# EAGLE design mosfet_ver2 (EAGLE 6.6.0)
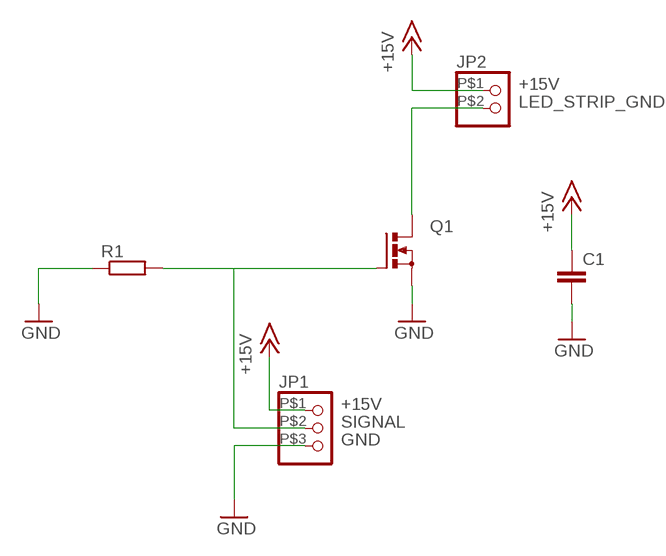
[diagram p0: schematic, sheet 1]

## Parts
C1  C-EU050-025X075  [C050-025X075]
JP1  PINHD-1X35.08  [1X03/5.08]
JP2  PINHD-1X2/5.08  [1X02/5.08]
Q1  PMOSFET_NTO220BV  [TO220BV]
R1  R-EU_M0805  [M0805]

## Nets
+15V: C1.1 JP1.P$1 JP2.P$1
GND: C1.2 JP1.P$3 Q1.S R1.1
LED_STRIP_GND: JP2.P$2 Q1.D
SIGNAL: JP1.P$2 Q1.G R1.2

## Library data of the parts
C1 = rcl:C-EU: CAPACITOR, European symbol
JP1 = 1omat:PINHD-1X3: PIN HEADER
JP2 = 1omat:PINHD-1X2: PIN HEADER
Q1 = transistor-power:PMOSFET_N: Power MOSFET N-Channel
R1 = resistor:R-EU_: RESISTOR, European symbol

## Board
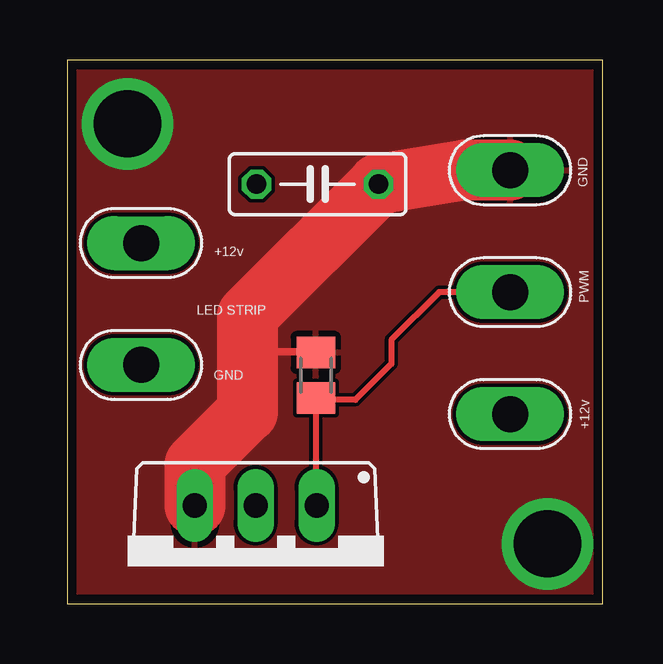
[diagram p1: board, top side]
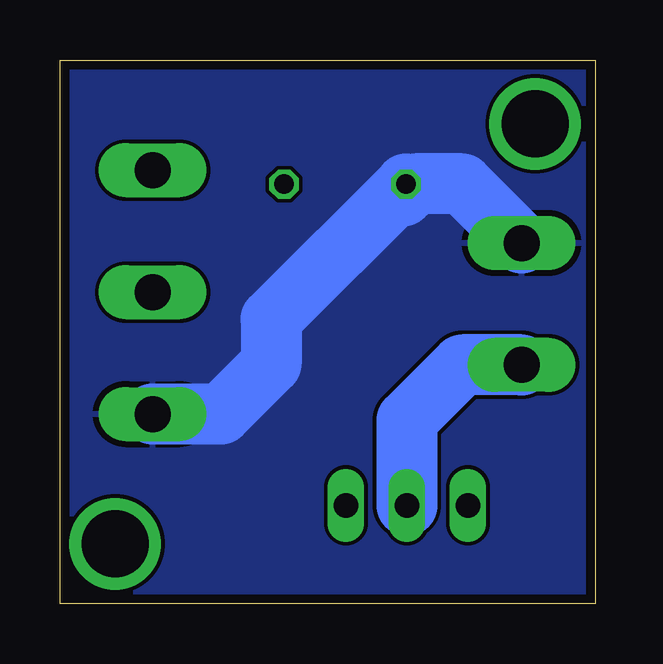
[diagram p2: board, bottom side, seen from below]

Size 22.3 x 22.66 mm. Coordinates in mm from the lower left corner, seen from the top.
Outline: 0,0 22.3,0 22.3,22.66 0,22.66 0,0
Copper layers (1*16): Top 0.0356mm / dielectric 1.5011mm / Bottom 0.0356mm
Design rules "LaenPCBOrder": minimum track width 6mil, minimum drill 13mil, track to track 6mil, track to pad 6mil, pad to pad 6mil, via to via 6mil, smd to smd 6mil, copper to edge 15mil, drill to drill 6mil, minimum pad ring 7mil, minimum via ring 7mil, stop-mask expansion 3mil, vias tented up to drill 0mil, thermal gap 10mil

### Footprints (pad centres in the part's own frame; a part is rotated, then mirrored left to right if it is on the bottom)
C050-025X075 = drill 0.813 octagon: 1 -2.54,0; 2 2.54,0
1X03/5.08 = drill 1.5 long: P$1 -5.08,0; P$2 0,0; P$3 5.08,0
1X02/5.08 = drill 1.5 long: P$1 -2.54,0; P$2 2.54,0
TO220BV = drill 1.016 long: D 0,-2.54; G -2.54,-2.54; S 2.54,-2.54
M0805 = smd 1.3 x 1.6: 1 -0.95,0; 2 0.95,0

### Placement (x,y rotation side)
C1  10.42,17.49 0 top
JP1  18.44,12.99 90 top
JP2  3.07,12.49 270 top
Q1  7.85,1.56 180 top
R1  10.35,9.52 270 top

### Tracks (layer width: path | path; a pad name or v marks a point on that pad's centre or on a via)
+15V
  Bottom 2.54: JP1.P$1 15.59,7.91 13.5,10 13.5,11.87 C1.1 7.88,17.12 | JP2.P$1 5.53,17.5 7.5,17.5 7.88,17.12 | 8,17 7.88,17.12
  pour Bottom: 0.23,22.48 0.23,0.06 22.18,0.06 22.18,22.48
GND  (via drill 2.8)
  Top 0.305: R1.1 10.33,10.5 7.5,10.5
  Top 2.54: JP1.P$3 16.54,18.07 C1.2 7.5,12.02 7.5,10.5 7.5,8 5.31,5.81 Q1.S
  other vias: 2.5,20 20,2.5
  pour Top: 0.23,22.46 0.23,0.2 22.03,0.2 22.03,22.46
LED_STRIP_GND
  Bottom 2.54: JP2.P$2 5.54,9.96 7.85,7.65 Q1.D
SIGNAL
  Top 0.254: JP1.P$2 15.49,12.99 13.5,11 13.5,10 12,8.5 10.43,8.5 R1.2 10.35,4.13 Q1.G

### Text on the board
tNames: GND | +12v | PWM | LED STRIP | GND | +12v